# EAGLE design cropdroid-room (EAGLE 9.7.0)
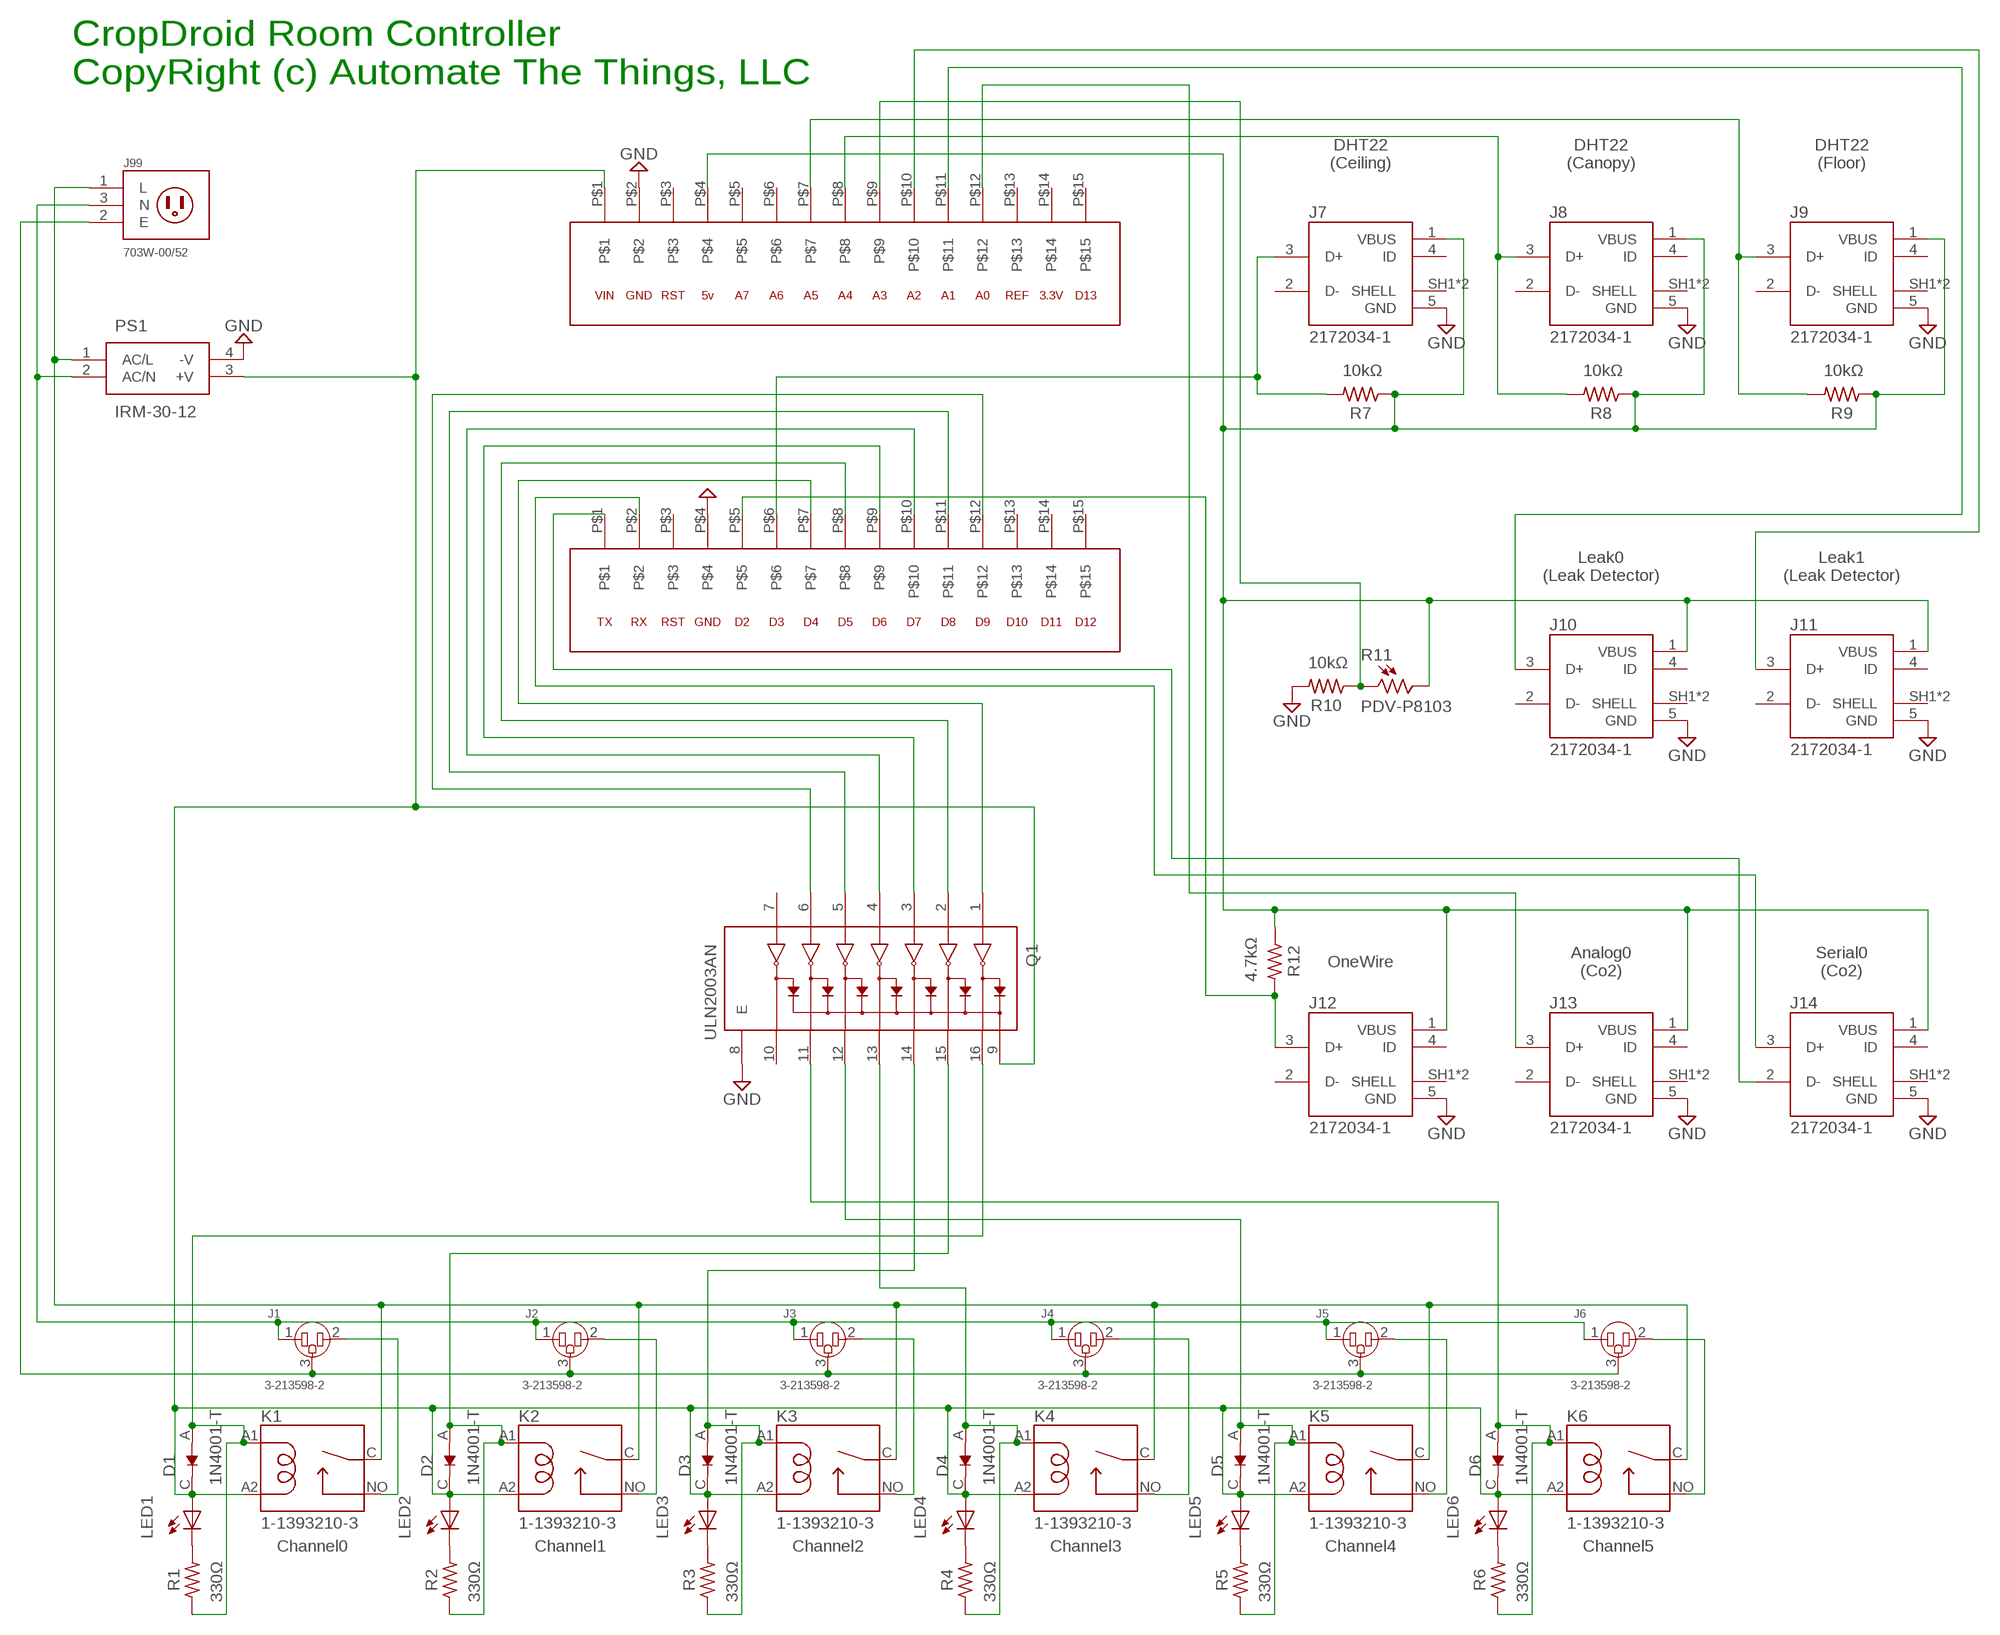
[diagram p0: schematic, sheet 1]

## Parts
D1  1N4001-T  [DIOAD953W69L521D272]
D2  1N4001-T  [DIOAD953W69L521D272]
D3  1N4001-T  [DIOAD953W69L521D272]
D4  1N4001-T  [DIOAD953W69L521D272]
D5  1N4001-T  [DIOAD953W69L521D272]
D6  1N4001-T  [DIOAD953W69L521D272]
J1  3-213598-2  [TE_3-213598-2]
J2  3-213598-2  [TE_3-213598-2]
J3  3-213598-2  [TE_3-213598-2]
J4  3-213598-2  [TE_3-213598-2]
J5  3-213598-2  [TE_3-213598-2]
J6  3-213598-2  [TE_3-213598-2]
J7  2172034-1  [TE_2172034-1]
J8  2172034-1  [TE_2172034-1]
J9  2172034-1  [TE_2172034-1]
J10  2172034-1  [TE_2172034-1]
J11  2172034-1  [TE_2172034-1]
J12  2172034-1  [TE_2172034-1]
J13  2172034-1  [TE_2172034-1]
J14  2172034-1  [TE_2172034-1]
J99  703W-00/52  [QUALTEK_703W-00/52]
K1  1-1393210-3  [TE_1-1393210-3]
K2  1-1393210-3  [TE_1-1393210-3]
K3  1-1393210-3  [TE_1-1393210-3]
K4  1-1393210-3  [TE_1-1393210-3]
K5  1-1393210-3  [TE_1-1393210-3]
K6  1-1393210-3  [TE_1-1393210-3]
LED1  LED3MM  [LED3MM]
LED2  LED3MM  [LED3MM]
LED3  LED3MM  [LED3MM]
LED4  LED3MM  [LED3MM]
LED5  LED3MM  [LED3MM]
LED6  LED3MM  [LED3MM]
PS1  IRM-30-12  [IRM3048]
Q1  ULN2003AN  [DIP794W45P254L1969H508Q16]
R1  330Ω  R-US_AXIAL-7.2MM-PITCH  [RESAD724W46L381D178B]
R2  330Ω  R-US_AXIAL-7.2MM-PITCH  [RESAD724W46L381D178B]
R3  330Ω  R-US_AXIAL-7.2MM-PITCH  [RESAD724W46L381D178B]
R4  330Ω  R-US_AXIAL-7.2MM-PITCH  [RESAD724W46L381D178B]
R5  330Ω  R-US_AXIAL-7.2MM-PITCH  [RESAD724W46L381D178B]
R6  330Ω  R-US_AXIAL-7.2MM-PITCH  [RESAD724W46L381D178B]
R7  10kΩ  R-US_AXIAL-7.2MM-PITCH  [RESAD724W46L381D178B]
R8  10kΩ  R-US_AXIAL-7.2MM-PITCH  [RESAD724W46L381D178B]
R9  10kΩ  R-US_AXIAL-7.2MM-PITCH  [RESAD724W46L381D178B]
R10  10kΩ  R-US_AXIAL-7.2MM-PITCH  [RESAD724W46L381D178B]
R11  PDV-P8103  [PHODET_PDV-P8103]
R12  4.7kΩ  R-US_AXIAL-7.2MM-PITCH  [RESAD724W46L381D178B]
U$2  PPTC151LFBN-RC  [PPTC151LFBN-RC]
U$4  PPTC151LFBN-RC  [PPTC151LFBN-RC]

## Nets
GND: J7.5(GND) J8.5(GND) J9.5(GND) J10.5(GND) J11.5(GND) J12.5(GND) J13.5(GND) J14.5(GND) PS1.4(-V) Q1.8(E) R10.2 U$2.P$4 U$4.P$2
N$1: D1.A K1.A1 Q1.16(1C) R1.1
N$2: LED1.K(C) R1.2
N$3: D1.C D2.C D3.C D4.C D5.C D6.C K1.A2 K2.A2 K3.A2 K4.A2 K5.A2 K6.A2 LED1.A LED2.A LED3.A LED4.A LED5.A LED6.A PS1.3(+V) Q1.9(COM) U$4.P$1
N$4: LED2.K(C) R2.2
N$5: D2.A K2.A1 Q1.15(2C) R2.1
N$6: LED3.K(C) R3.2
N$7: D3.A K3.A1 Q1.14(3C) R3.1
N$8: LED4.K(C) R4.2
N$9: D4.A K4.A1 Q1.13(4C) R4.1
N$10: LED5.K(C) R5.2
N$11: D5.A K5.A1 Q1.12(5C) R5.1
N$12: LED6.K(C) R6.2
N$13: R10.1 R11.1 U$4.P$9
N$14: J12.3(D+) R12.2 U$2.P$5
N$15: Q1.6(6B) U$2.P$12
N$16: Q1.5(5B) U$2.P$11
N$17: Q1.4(4B) U$2.P$10
N$18: Q1.3(3B) U$2.P$9
N$19: Q1.2(2B) U$2.P$8
N$20: Q1.1(1B) U$2.P$7
N$21: D6.A K6.A1 Q1.11(6C) R6.1
N$22: J10.3(D+) U$4.P$11
N$23: J11.3(D+) U$4.P$10
N$24: J8.3(D+) R8.2 U$4.P$8
N$25: J14.3(D+) U$2.P$2
N$29 [PowerSupply]: J99.1(L) K1.C K2.C K3.C K4.C K5.C K6.C PS1.1(AC/L)
N$30: J7.1(VBUS) J8.1(VBUS) J9.1(VBUS) J10.1(VBUS) J11.1(VBUS) J12.1(VBUS) J13.1(VBUS) J14.1(VBUS) R7.1 R8.1 R9.1 R11.2 R12.1 U$4.P$4
N$31 [MainsAC]: J1.3 J2.3 J3.3 J4.3 J5.3 J6.3 J99.2(E)
N$32 [MainsAC]: J1.2 K1.NO
N$33 [MainsAC]: J2.2 K2.NO
N$34 [MainsAC]: J3.2 K3.NO
N$35 [MainsAC]: J4.2 K4.NO
N$36 [MainsAC]: J5.2 K5.NO
N$37 [MainsAC]: J6.2 K6.NO
N$39 [PowerSupply]: J1.1 J2.1 J3.1 J4.1 J5.1 J6.1 J99.3(N) PS1.2(AC/N)
N$40: J9.3(D+) R9.2 U$4.P$7
N$42: J7.3(D+) R7.2 U$2.P$6
N$43: J13.3(D+) U$4.P$12
N$46: J14.2(D-) U$2.P$1
Unconnected: J7.2(D-) J7.4(ID) J8.2(D-) J8.4(ID) J9.2(D-) J9.4(ID) J10.2(D-) J10.4(ID) J11.2(D-) J11.4(ID) J12.2(D-) J12.4(ID) J13.2(D-) J13.4(ID) J14.4(ID) Q1.7(7B) Q1.10(7C) U$2.P$3 U$2.P$13 U$2.P$14 U$2.P$15 U$4.P$3 U$4.P$5 U$4.P$6 U$4.P$13 U$4.P$14 U$4.P$15

## Notes on the sheet
- CropDroid Room Controller
  CopyRight (c) Automate The Things, LLC
- DHT22
  (Ceiling)
- DHT22
  (Canopy)
- DHT22
  (Floor)
- VIN | GND | RST | 5v | A7 | A6 | A5 | A4 | A3 | A2 | A1 | A0 | REF | 3.3V | D13
- Leak0
  (Leak Detector)
- Leak1
  (Leak Detector)
- TX | RX | RST | GND | D2 | D3 | D4 | D5 | D6 | D7 | D8 | D9 | D10 | D11 | D12
- OneWire
- Analog0
  (Co2)
- Serial0
  (Co2)
- Channel0 | Channel1 | Channel2 | Channel3 | Channel4 | Channel5

## Power pins joined to a net without a drawn wire
SHELL: J7.SH1(SHELL) J7.SH2(SHELL) J8.SH1(SHELL) J8.SH2(SHELL) J9.SH1(SHELL) J9.SH2(SHELL) J10.SH1(SHELL) J10.SH2(SHELL) J11.SH1(SHELL) J11.SH2(SHELL) J12.SH1(SHELL) J12.SH2(SHELL) J13.SH1(SHELL) J13.SH2(SHELL) J14.SH1(SHELL) J14.SH2(SHELL)

## Library data of the parts
D1-D6 = 1N4001-T:1N4001-T: Diode, Standard Recovery, 1a, 50v, Do-204al-2, Full Reel Check prices <https://pricing.snapeda.com/parts/1N4001/ON%20Semiconductor/view-part?ref=eda>; AVAILABILITY: In Stock; DESCRIPTION: DIODE; 1 A (MAX.) @ 25C IF; 1.1 V (MAX.) @ 25C; 5 UADC (MAX.) @ 25C IR; MF: ON Semiconductor; MP: 1N4001; PACKAGE: DO-41 HVCA; PRICE: None
J1-J6 = 3-213598-2:3-213598-2: Conn Power RCP 2Power/1Ground POS 12.7mm Solder ST Thru-Hole 3 Terminal 1 Port Check prices <https://pricing.snapeda.com/parts/3-213598-2/TE%20Connectivity/view-part?ref=eda>; AVAILABILITY: In Stock; COMMENT: 3-213598-2; DESCRIPTION: OUTLET ASSEMBLY, 15A, CONVENIENCE; Series:-; Gender:Receptacle; Current Rating:1; EU_ROHS_COMPLIANCE: Compliant; MF: TE Connectivity; MP: 3-213598-2; PACKAGE: None; PRICE: None; PRODUCT_TYPE: Convenience Outlet; PURCHASE-URL: https://pricing.snapeda.com/search/part/3-213598-2/?ref=eda
J7-J14 = 2172034-1:2172034-1: CONN RCPT USB MINI B 2.0 PCB R/A Check prices <https://pricing.snapeda.com/parts/2172034-1/TE%20Connectivity/view-part?ref=eda>; AVAILABILITY: In Stock; COMMENT: 2172034-1; DESCRIPTION: Conn Mini USB Type B RCP 5 POS 0.8mm Solder RA Thru-Hole 5 Terminal 1 Port Box/Tray; EU_ROHS_COMPLIANCE: Compliant; MF: TE Connectivity; MP: 2172034-1; PACKAGE: None; PRICE: None; PURCHASE-URL: https://pricing.snapeda.com/search/part/2172034-1/?ref=eda
J99 = 703W-00_52:703W-00/52: 3 Position 250 V 10 A Male Pins AC Receptacle Right Angle Connector Check prices <https://pricing.snapeda.com/parts/703W-00/52/Qualtek/view-part?ref=eda>; AVAILABILITY: In Stock; DESCRIPTION: Power Entry Connector Receptacle, Male Blades IEC 320-C14 Panel Mount, Flange; Through Hole, Right Angle; MF: Qualtek; MP: 703W-00/52; PACKAGE: None; PRICE: None
K1-K6 = 1-1393210-3:1-1393210-3: Electromechanical Relay 12VDC 144Ohm 30A SPST-NO (( 32.51mm 27.43mm 20.4mm)) THT Industrial Relay Check prices <https://pricing.snapeda.com/parts/T9AS1D12-12/TE%20Connectivity/view-part?ref=eda>; AVAILABILITY: In Stock; COMMENT: 1-1393210-3; DESCRIPTION: Electromechanical Relay 12VDC 144Ohm 30A SPST-NO (( 32.51mm 27.43mm 20.4mm)) THT Industrial Relay; MF: TE Connectivity; MP: T9AS1D12-12; PACKAGE: None; PRICE: None; PURCHASE-URL: https://pricing.snapeda.com/search/part/T9AS1D12-12/?ref=eda
LED1-LED6 = adafruit:LED: LED OSRAM: - CHIPLED LG R971, LG N971, LY N971, LG Q971, LY Q971, LO R971, LY R971 LH N974, LH R974 LS Q976, LO Q976, LY Q976 LO Q996 - Hyper CHIPLED LW Q18S LB Q993, LB Q99A, LB R99A - SideLED LS A670, LO A670, LY A670, LG A670, LP A670 LB A673, LV A673, LT A673, LW A673 LH A674 LY A675 LS A676, LA A676, LO A676, LY A676, LW A676 LS A679, LY A679, LG A679 - Hyper Micro SIDELED® LS Y876, LA Y876, LO Y876, LY Y876 LT Y87S - SmartLED LW L88C, LW L88S LB L89C, LB L89S, LG L890 LS L89K, LO L89K, LY L89K LS L896, LA L896, LO L896, LY L896 - TOPLED LS T670, LO T670, LY T670, LG T670, LP T670 LSG T670, LSP T670, LSY T670, LOP T670, LYG T670 LG T671, LOG T671, LSG T671 LB T673, LV T673, LT T673, LW T673 LH T674 LS T676, LA T676, LO T676, LY T676, LB T676, LH T676, LSB T676, LW T676 LB T67C, LV T67C, LT T67C, LS T67K, LO T67K, LY T67K, LW E67C LS E67B, LA E67B, LO E67B, LY E67B, LB E67C, LV E67C, LT E67C LW T67C LS T679, LY T679, LG T679 LS T770, LO T770, LY T770, LG T770, LP T770 LB T773, LV T773, LT T773, LW T773 LH T774 LS E675, LA E675, LY E675, LS T675 LS T776, LA T776, LO T776, LY T776, LB T776 LHGB T686 LT T68C, LB T68C - Hyper Mini TOPLED® LB M676 - Mini TOPLED Santana® LG M470 LS M47K, LO M47K, LY M47K Source: http://www.osram.convergy.de/
PS1 = IRM-30-12:IRM-30-12: Power Supply Encapsulated PCB 12V 30W Source: Datasheet <http://www.meanwell.com/Upload/PDF/IRM-30/IRM-30-SPEC.PDF>; ARROW_PART_NUMBER: IRM-30-12; ARROW_PRICE-STOCK: https://www.arrow.com/en/products/irm-30-12/mean-well-enterprises; DESCRIPTION: Power Supply Encapsulated PCB 12V 30W; HEIGHT: 24mm; MANUFACTURER_NAME: Mean Well; MANUFACTURER_PART_NUMBER: IRM-30-12; MOUSER_PART_NUMBER: 709-IRM30-12; MOUSER_PRICE-STOCK: https://www.mouser.co.uk/ProductDetail/MEAN-WELL/IRM-30-12?qs=Ubm%252Bqu3%2FQAv0qUuIjQjetQ%3D%3D
Q1 = ULN2003AN:ULN2003AN: Check prices <https://pricing.snapeda.com/parts/ULN2003AN/Texas%20Instruments/view-part?ref=eda>; AVAILABILITY: In Stock; DESCRIPTION: 50-V, 7-ch darlington transistor array, -20C to 70C 16-PDIP -40 to 70; MF: Texas Instruments; MP: ULN2003AN; PACKAGE: PDIP-16 Texas Instruments; PRICE: None; PURCHASE-URL: https://pricing.snapeda.com/search/part/ULN2003AN/?ref=eda
R1-R10 R12 = Resistor:R-US: Resistor Fixed - ANSI; CATEGORY: Resistor; SUB-CATEGORY: Fixed
R11 = PDV-P8103:PDV-P8103: THT Photocell 16-33 Kohm Check prices <https://pricing.snapeda.com/parts/PDV-P8103/Advanced%20Photonix/view-part?ref=eda>; AVAILABILITY: In Stock; DESCRIPTION: CdS Cells 520nm 16 ~ 33kOhms @ 10 lux; MF: Advanced Photonix; MP: PDV-P8103; PACKAGE: Radial Advanced Photonix; PRICE: None
U$2 U$4 = PPTC151LFBN-RC:PPTC151LFBN-RC: Check prices <https://pricing.snapeda.com/parts/PPTC151LFBN-RC/Sullins%20Connector/view-part?ref=eda>; AVAILABILITY: In Stock; DESCRIPTION: 15 Position Header Connector 0.100 (2.54mm) Through Hole Tin; MF: Sullins Connector; MP: PPTC151LFBN-RC; PACKAGE: None; PRICE: None

## Net classes
0 default: width 0.254 mm, drill 0.381 mm, clearance 0.254 mm
1 MainsAC: width 6.299 mm, drill 0.381 mm, clearance 0.6 mm
2 PowerSupply: width 0.711 mm, drill 0.381 mm, clearance 0.254 mm

## Board
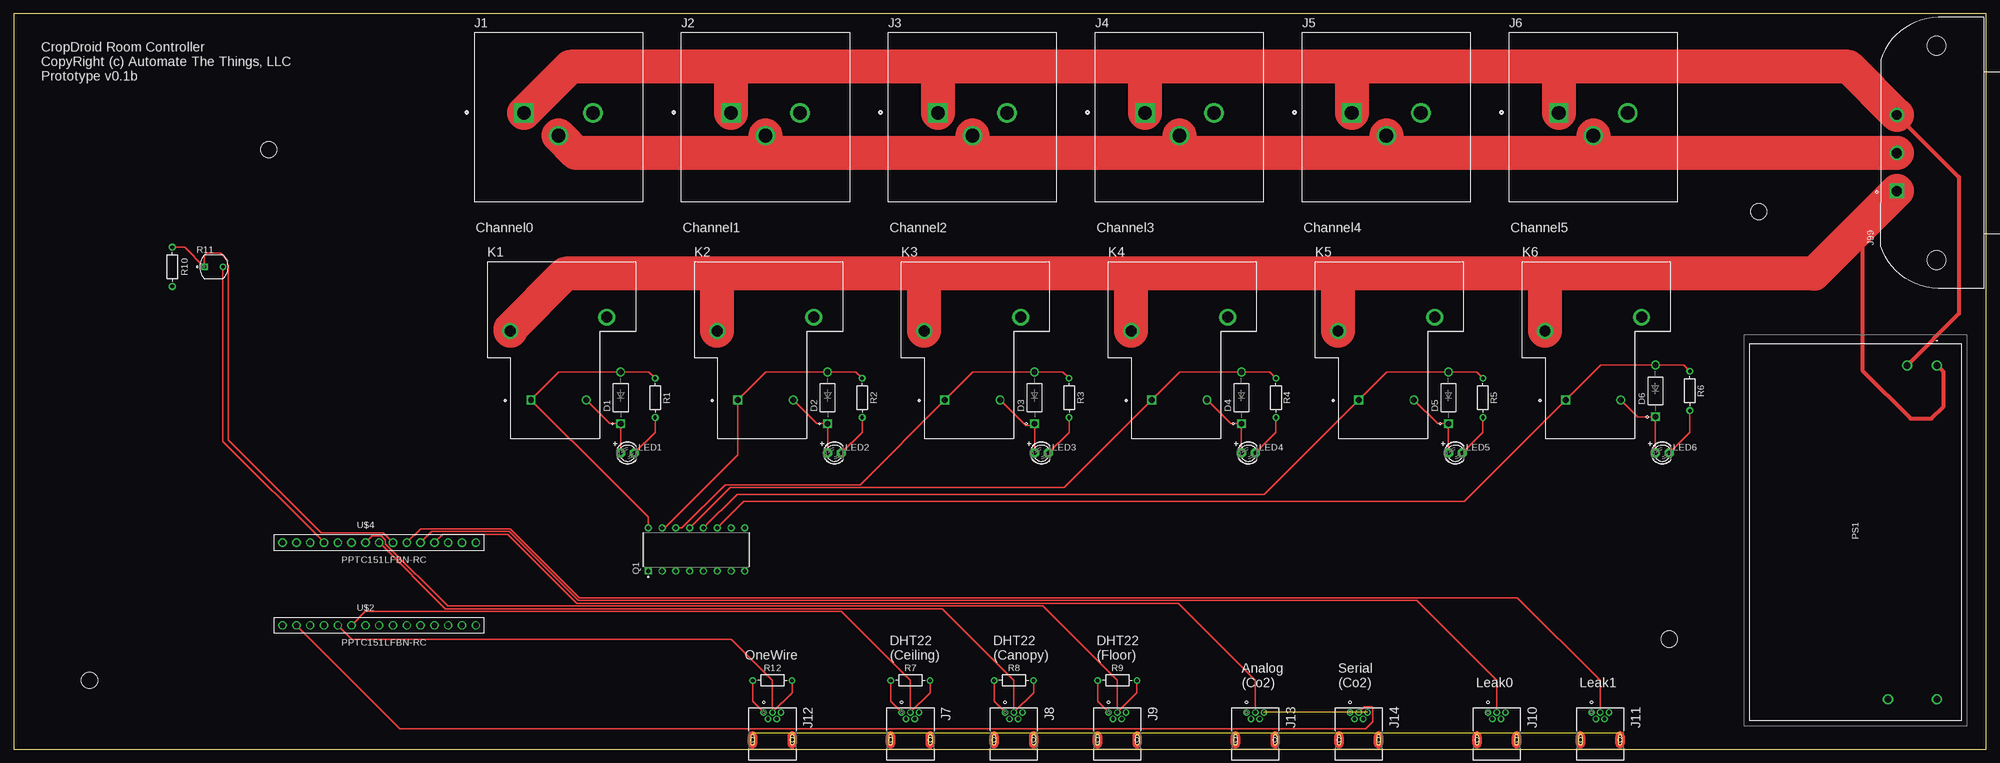
[diagram p1: board, top side]
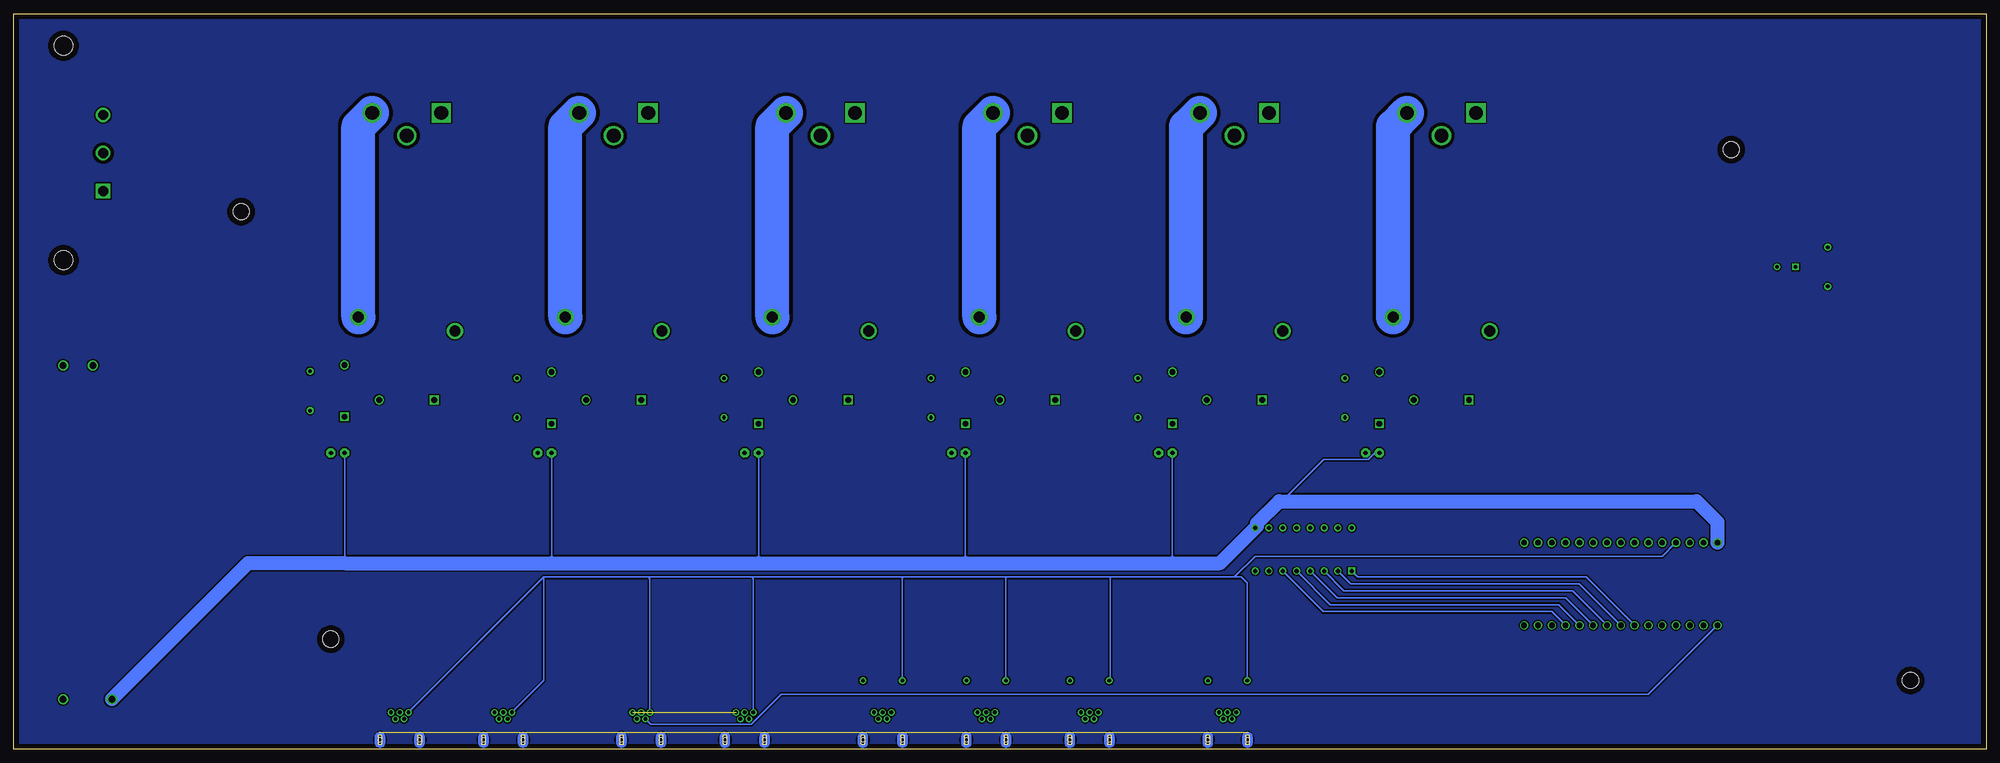
[diagram p2: board, bottom side, seen from below]

Size 363.2 x 135.56 mm. Coordinates in mm from the lower left corner, seen from the top.
Outline: 0,0 363.2,0 363.2,135.56 0,135.56 0,0
Copper layers (1*16): Top / Bottom
Stack-up Default Layer Stack: Top User Defined 0.035mm / Dielectric-1 User Defined 1.5mm / Bottom User Defined 0.035mm
Design rules: minimum copper width class=1 248mil, minimum copper width class=2 28mil, minimum copper width class=0 10mil, minimum copper width 10mil, minimum drill size class=1 15mil, minimum drill size class=2 15mil, minimum drill size class=0 15mil, minimum drill size 0.35mm, copper clearance class=1 to class=1 0.6mm, copper clearance class=2 to class=2 10mil, copper clearance class=0 to class=0 10mil, copper clearance wire_polygon to wire_polygon 10mil, copper clearance wire_polygon to pad_smd 10mil, copper clearance wire_polygon to via 10mil, copper clearance pad_smd to pad_smd 10mil, copper clearance pad_smd to via 10mil, copper clearance via to via 10mil, copper clearance smd to pad (same net) 6mil, copper clearance smd to via (same net) 6mil, copper clearance smd to smd (same net) 6mil, dimension clearance 40mil, via restrict clearance 0mil, restrict clearance 0mil, drill distance 6mil, keepout clearance 0mil
Holes 3 mm at 321.31,99.06 46.99,110.49 13.97,12.7 304.8,20.32

### Footprints (pad centres in the part's own frame; a part is rotated, then mirrored left to right if it is on the bottom)
DIOAD953W69L521D272 = drill 1.06 pad 1.59: A 4.765,0 | drill 1.06 pad 1.59 square: C -4.765,0
TE_3-213598-2 = drill 2.54 square: 1 -6.35,0.81 | drill 2.54: 2 6.35,0.81; 3 0,-3.38
TE_2172034-1 = drill 0.7: 1 -5.05,-1.6; 2 -3.85,-0.8; 3 -5.05,0; 4 -3.85,0.8; 5 -5.05,1.6 | smd 0.1 x 0.1: SH1 -1.27,3.81; SH2 -1.27,-3.81 | hole 0.7: 0,3.65; 0,-3.65
QUALTEK_703W-00/52 = drill 1.8 square: 1 0,0 | drill 1.8: 2 7,0; 3 14,0 | hole 3.5: 26.75,-7.3; -12.75,-7.3
TE_1-1393210-3 = drill 1.09 square: A1 0,0 | drill 1.09: A2 10.16,0 | drill 1.98: C -3.81,12.7 | drill 2.06: NO 13.97,15.24
LED3MM = drill 0.813 pad 1.676 octagon: A -1.27,0; K 1.27,0
IRM3048 = drill 1.24 pad 1.86: 1 -30.425,15; 2 -30.425,9.5; 3 31.075,6; 4 31.075,15
DIP794W45P254L1969H508Q16 = drill 0.78 pad 1.13 square: 1 -3.97,8.89 | drill 0.78 pad 1.13: 2 -3.97,6.35; 3 -3.97,3.81; 4 -3.97,1.27; 5 -3.97,-1.27; 6 -3.97,-3.81; 7 -3.97,-6.35; 8 -3.97,-8.89; 9 3.97,-8.89; 10 3.97,-6.35; 11 3.97,-3.81; 12 3.97,-1.27; 13 3.97,1.27; 14 3.97,3.81; 15 3.97,6.35; 16 3.97,8.89
RESAD724W46L381D178B = drill 0.66 pad 1.26: 1 -3.62,0; 2 3.62,0
PHODET_PDV-P8103 = drill 0.65 square: 1 -1.7,0 | drill 0.65: 2 1.7,0
PPTC151LFBN-RC = drill 1.02: P$1 0,0; P$2 2.54,0; P$3 5.08,0; P$4 7.62,0; P$5 10.16,0; P$6 12.7,0; P$7 15.24,0; P$8 17.78,0; P$9 20.32,0; P$10 22.86,0; P$11 25.4,0; P$12 27.94,0; P$13 30.48,0; P$14 33.02,0; P$15 35.56,0

### Placement (x,y rotation side)
D1  111.76,64.77 90 top
D2  149.86,64.77 90 top
D3  187.96,64.77 90 top
D4  226.06,64.77 90 top
D5  264.16,64.77 90 top
D6  302.26,66.04 90 top
J1  100.33,116.46 0 top
J2  138.43,116.46 0 top
J3  176.53,116.46 0 top
J4  214.63,116.46 0 top
J5  252.73,116.46 0 top
J6  290.83,116.46 0 top
J7  165.1,1.78 270 top
J8  184.15,1.78 270 top
J9  203.2,1.78 270 top
J10  273.05,1.78 270 top
J11  292.1,1.78 270 top
J12  139.7,1.78 270 top
J13  228.6,1.78 270 top
J14  247.65,1.78 270 top
J99  346.71,102.87 90 top
K1  95.25,64.39 0 top
K2  133.35,64.39 0 top
K3  171.45,64.39 0 top
K4  209.55,64.39 0 top
K5  247.65,64.39 0 top
K6  285.75,64.39 0 top
LED1  113.03,54.61 0 top
LED2  151.13,54.61 0 top
LED3  189.23,54.61 0 top
LED4  227.33,54.61 0 top
LED5  265.43,54.61 0 top
LED6  303.53,54.61 0 top
PS1  339.09,40.32 270 top
Q1  125.73,36.83 90 top
R1  118.11,64.77 270 top
R2  156.21,64.77 270 top
R3  194.31,64.77 270 top
R4  232.41,64.77 270 top
R5  270.51,64.77 270 top
R6  308.61,66.04 270 top
R7  165.1,12.7 0 top
R8  184.15,12.7 0 top
R9  203.2,12.7 0 top
R10  29.21,88.9 270 top
R11  36.83,88.9 0 top
R12  139.7,12.7 0 top
U$2  49.53,22.86 0 top
U$4  49.53,38.1 0 top

### Tracks (layer width: path | path; a pad name or v marks a point on that pad's centre or on a via)
GND  (1 unrouted)
  pour Bottom: 0,135.56 0,0 363.2,0 363.2,135.56
N$1
  Top 0.254: R1.1 116.96,69.53 D1.A 100.4,69.53 K1.A1 110.3,49.34 110.49,49.15 116.84,42.8 Q1.16
N$2
  Top 0.254: LED1.K 118.11,58.42 R1.2
N$3
  Top 0.254: LED6.A D6.C 299.02,61.27 K6.A2 | LED5.A D5.C 262.19,60.01 K5.A2 | LED4.A D4.C 224.09,60.01 K4.A2 | 187.96,59.69 LED3.A | 187.96,59.69 D3.C | K3.A2 186.31,59.69 187.96,59.69 | LED2.A D2.C 147.89,60.01 K2.A2 | LED1.A D1.C 109.79,60.01 K1.A2
  Bottom 0.254: LED6.A 302.26,34.29 | Q1.9 122.03,53.39 113.79,53.39 112.58,54.61 LED1.A | LED5.A 264.16,34.29 | LED4.A 226.06,34.29 | LED3.A 187.96,34.29 | LED2.A 149.86,34.29
  Bottom 0.711: 319.88,34.29 320.05,34.29
  Bottom 2.54: 319.88,34.29 302.26,34.29 264.16,34.29 226.06,34.29 187.96,34.29 149.86,34.29 141.13,34.29 Q1.9 134.25,41.17 134.25,41.7 130.23,45.72 53.34,45.72 49.53,41.91 U$4.P$1 | 320.05,34.29 PS1.3
N$4
  Top 0.254: LED2.K 156.21,58.42 R2.2
N$5
  Top 0.254: R2.1 155.06,69.53 D2.A 138.5,69.53 K2.A1 133.35,54.23 119.92,40.8 Q1.15
N$6
  Top 0.254: LED3.K 194.31,58.42 R3.2
N$7
  Top 0.254: R3.1 193.16,69.53 D3.A 176.6,69.53 K3.A1 155.83,48.77 130.98,48.77 123.01,40.8 Q1.14
N$8
  Top 0.254: LED4.K 232.41,58.42 R4.2
N$9
  Top 0.254: R4.1 231.26,69.53 D4.A 214.7,69.53 K4.A1 193.42,48.26 131.92,48.26 Q1.13
N$10
  Top 0.254: R5.2 270.51,58.42 LED5.K
N$11
  Top 0.254: R5.1 269.37,69.53 D5.A 252.8,69.53 K5.A1 230.25,46.99 133.19,46.99 Q1.12
N$12
  Top 0.254: R6.2 308.61,58.42 LED6.K
N$13
  Top 0.254: R10.1 31.51,92.52 R11.1 35.13,91.01 35.56,91.44 38.1,91.44 39.37,90.17 39.37,89.42 39.49,89.3 39.49,57.03 56.64,39.88 68.07,39.88 U$4.P$9
N$14
  Top 0.254: R12.2 143.32,10.45 J12.3 139.7,12.7 132.08,20.32 62.23,20.32 U$2.P$5
N$15
  Bottom 0.254: U$2.P$12 80.01,25.4 122.08,25.4 Q1.6
N$16
  Bottom 0.254: Q1.5 120.81,26.67 78.74,26.67 U$2.P$11
N$17
  Bottom 0.254: Q1.4 119.54,27.94 77.47,27.94 U$2.P$10
N$18
  Bottom 0.254: Q1.3 118.27,29.21 76.2,29.21 U$2.P$9
N$19
  Bottom 0.254: Q1.2 117,30.48 74.93,30.48 U$2.P$8
N$20
  Bottom 0.254: Q1.1 115.73,31.75 73.66,31.75 U$2.P$7
N$21
  Top 0.254: R6.1 307.46,70.81 D6.A 292.17,70.81 K6.A1 267.08,45.72 134.46,45.72 Q1.11
N$22
  Top 0.254: U$4.P$11 76.96,40.13 91.23,40.13 103.93,27.43 258.32,27.43 273.05,12.7 J10.3
N$23
  Top 0.254: U$4.P$10 74.93,40.64 91.44,40.64 104.14,27.94 276.86,27.94 292.1,12.7 J11.3
N$24
  Top 0.254: R8.2 187.77,10.45 J8.3 184.15,12.7 170.94,25.91 79.5,25.91 U$4.P$8
N$25
  Top 0.254: U$2.P$2 71.12,3.81 248.92,3.81 250.23,5.12 250.23,7.58 250,7.81 248.63,7.81 J14.3
N$29
  Top 0.711: J99.1 340.36,96.52 340.36,69.85 349.25,60.96 353.06,60.96 355.3,63.2 355.3,69.53 PS1.1
  Top 6.299: J99.1 331.47,87.63 281.94,87.63 | 281.94,87.63 243.84,87.63 | 243.84,87.63 205.74,87.63 | 205.74,87.63 167.64,87.63 | 167.64,87.63 129.54,87.63 | 129.54,87.63 101.6,87.63 91.44,77.47 K1.C | K2.C 129.54,87.63 | K3.C 167.64,87.63 | K4.C 205.74,87.63 | K5.C 243.84,87.63 | K6.C 281.94,87.63
N$30
  Top 0.254: J12.1 136.08,8.85 R12.1 | J7.1 161.48,8.85 R7.1 | J8.1 180.53,8.85 R8.1 | J9.1 199.58,8.85 R9.1 | U$4.P$4 38.53,56.72 R11.2
  Bottom 0.254: J11.1 265.58,31.75 | U$4.P$4 59.69,35.56 134.64,35.56 138.45,31.75 | 265.58,31.75 246.38,31.75 | 246.38,31.75 227.33,31.75 | 227.33,31.75 199.39,31.75 | 199.39,31.75 180.34,31.75 | 180.34,31.75 161.29,31.75 | 161.29,31.75 138.45,31.75 | 138.45,31.75 137.18,31.75 136.08,30.65 R12.1 | J14.1 246.05,31.42 246.38,31.75 | J13.1 227,31.42 227.33,31.75 | J10.1 265.58,12.7 265.58,31.75 | R7.1 161.29,12.89 161.29,31.75 | R8.1 180.53,31.56 180.34,31.75 | R9.1 199.58,31.56 199.39,31.75
N$31
  Top 6.299: J99.2 290.83,109.87 | 290.83,109.87 252.73,109.87 | 252.73,109.87 214.63,109.87 | 214.63,109.87 176.53,109.87 | 176.53,109.87 138.43,109.87 | 138.43,109.87 103.54,109.87 J1.3 | J2.3 138.43,109.87 | J3.3 176.53,109.87 | J4.3 214.63,109.87 | J5.3 252.73,109.87 | J6.3 290.83,109.87
N$32
  Bottom 6.299: K1.NO 109.22,114.73 J1.2
N$33
  Bottom 6.299: K2.NO 147.32,114.73 J2.2
N$34
  Bottom 6.299: K3.NO 185.42,114.73 J3.2
N$35
  Bottom 6.299: K4.NO 223.52,114.73 J4.2
N$36
  Bottom 6.299: K5.NO 261.62,114.73 J5.2
N$37
  Bottom 6.299: K6.NO 299.72,114.73 J6.2
N$39
  Top 0.711: J99.3 358.14,105.44 358.14,80.3 PS1.2
  Top 6.299: J99.3 337.85,125.73 284.48,125.73 | 284.48,125.73 246.38,125.73 | 246.38,125.73 208.28,125.73 | 208.28,125.73 170.18,125.73 | 170.18,125.73 132.08,125.73 | 132.08,125.73 102.44,125.73 J1.1 | J2.1 132.08,125.73 | 170.18,125.73 J3.1 | 208.28,125.73 J4.1 | 246.38,125.73 J5.1 | 284.48,125.73 J6.1
N$40
  Top 0.254: R9.2 206.82,10.45 J9.3 203.2,12.7 189.48,26.42 79.91,26.42 68.46,37.87 68.46,38.58 67.66,39.37 66.04,39.37 U$4.P$7
N$42
  Top 0.254: R7.2 168.72,10.45 J7.3 165.1,12.7 152.4,25.4 64.77,25.4 U$2.P$6
N$43
  Top 0.254: U$4.P$12 78.99,39.62 91.02,39.62 103.72,26.92 214.38,26.92 228.6,12.7 J13.3
N$46
  Bottom 0.254: U$2.P$1 62.23,10.16 221.88,10.16 227.39,4.64 245.86,4.64 J14.2
SHELL  (15 unrouted)

### Text on the board
tPlace: CropDroid Room Controller / CopyRight (c) Automate The Things, LLC / Prototype v0.1b | Channel0 | Channel1 | Channel2 | Channel3 | Channel4 | Channel5 | OneWire | DHT22 / (Ceiling) | DHT22 / (Canopy) | DHT22 / (Floor) | Analog / (Co2) | Serial / (Co2) | Leak0 | Leak1